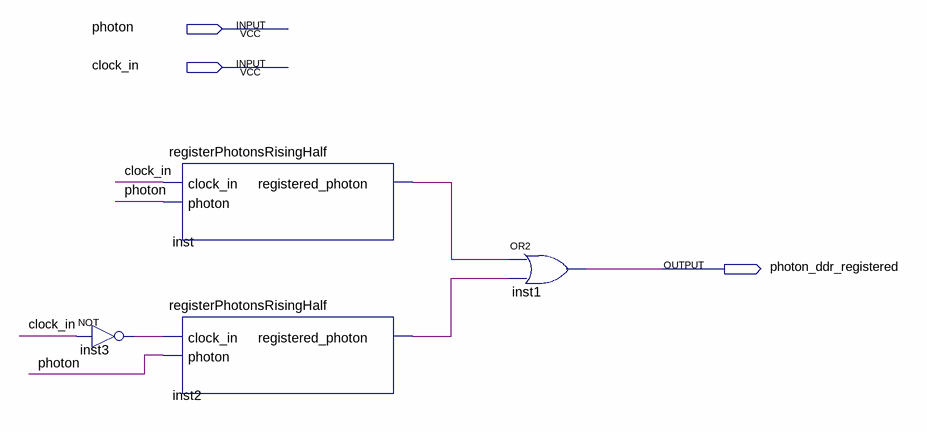
[diagram p0: schematic sheet]
// Quartus schematic registerPhotonsToClock.bdf as structural Verilog: 4 symbols, 3 pins
module registerPhotonsToClock (
  input  photon,
  input  clock_in,
  output photon_ddr_registered
);

  wire inst2_registered_photon, inst3_out, inst_registered_photon;

  not inst3 (inst3_out, clock_in);
  registerPhotonsRisingHalf inst (.clock_in(clock_in), .photon(photon), .registered_photon(inst_registered_photon));
  registerPhotonsRisingHalf inst2 (.clock_in(inst3_out), .photon(photon), .registered_photon(inst2_registered_photon));
  or inst1 (photon_ddr_registered, inst_registered_photon, inst2_registered_photon);
endmodule
